# EAGLE design untitled (EAGLE 9.4.1)

## Sheet 1 of 2
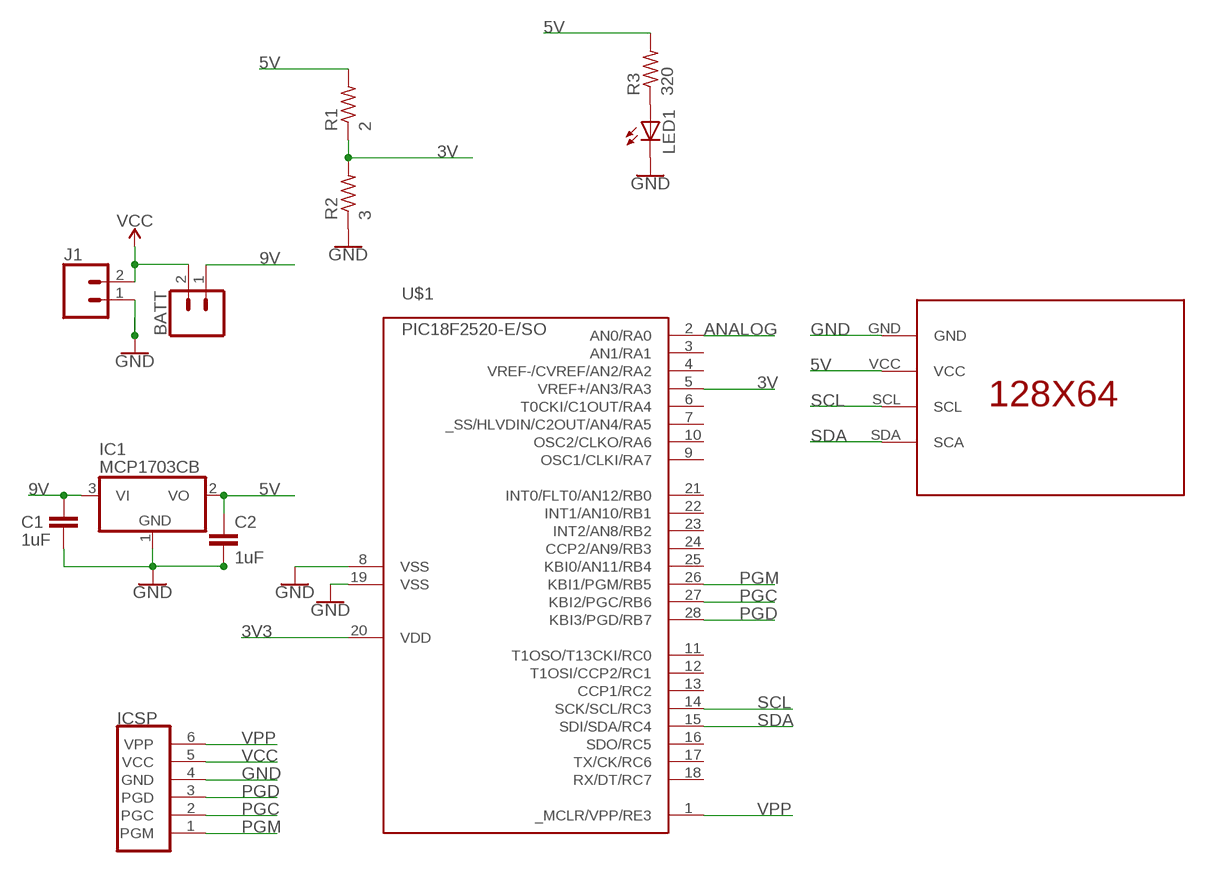
[diagram p0: schematic, sheet 1]

### Parts
BATT  CONN_02  [1X02]
C1  1uF  CAPACITOR-N0805  [0805]
C2  1uF  CAPACITOR-N0805  [0805]
IC1  MCP1703CB  [SOT23]
ICSP  PIC_ICSP_6_PIN  [MOLEX-1X6]
J1  CONN_02  [1X02]
LED1  LEDCHIP-LED0805  [CHIP-LED0805]
R1  2  R-US_R0805  [R0805]
R2  3  R-US_R0805  [R0805]
R3  320  R-US_R0805  [R0805]
U$1  PIC18F2520-E/SO  [SO-28W]
U$2  128_64_OLED_SPI  [128_64_OLED_SPI]

### Nets
3V: R1.1 R2.2 U$1.5(VREF+/AN3/RA3)
3V3: U$1.20(VDD)
5V: C2.1 IC1.2(VO) R1.2 R3.2 U$2.VCC ; also sheet 2
9V: BATT.1 C1.1 IC1.3(VI)
ANALOG: U$1.2(AN0/RA0) ; also sheet 2
GND: C1.2 C2.2 IC1.1(GND) ICSP.4(GND) J1.1 LED1.C R2.1 U$1.8(VSS) U$1.19(VSS) U$2.GND ; also sheet 2
N$1: LED1.A R3.1
PGC: ICSP.2(PGC) U$1.27(KBI2/PGC/RB6)
PGD: ICSP.3(PGD) U$1.28(KBI3/PGD/RB7)
PGM: ICSP.1(PGM) U$1.26(KBI1/PGM/RB5)
SCL: U$1.14(SCK/SCL/RC3) U$2.SCL
SDA: U$1.15(SDI/SDA/RC4) U$2.SDA(SCA)
VCC: BATT.2 ICSP.5(VCC) J1.2
VPP: ICSP.6(VPP) U$1.1(_MCLR/VPP/RE3)
Unconnected: U$1.3(AN1/RA1) U$1.4(VREF-/CVREF/AN2/RA2) U$1.6(T0CKI/C1OUT/RA4) U$1.7(_SS/HLVDIN/C2OUT/AN4/RA5) U$1.9(OSC1/CLKI/RA7) U$1.10(OSC2/CLKO/RA6) U$1.11(T1OSO/T13CKI/RC0) U$1.12(T1OSI/CCP2/RC1) U$1.13(CCP1/RC2) U$1.16(SDO/RC5) U$1.17(TX/CK/RC6) U$1.18(RX/DT/RC7) U$1.21(INT0/FLT0/AN12/RB0) U$1.22(INT1/AN10/RB1) U$1.23(INT2/AN8/RB2) U$1.24(CCP2/AN9/RB3) U$1.25(KBI0/AN11/RB4)

## Sheet 2 of 2
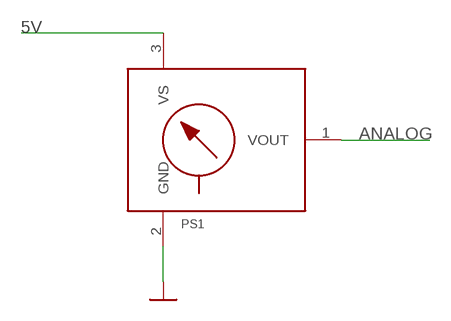
[diagram p1: schematic, sheet 2]

### Parts
PS1  MPX-867B-H  [867B-H]

### Nets
5V: PS1.3(VS) ; also sheet 1
ANALOG: PS1.1(VOUT) ; also sheet 1
GND: PS1.2(GND) ; supply symbol labelled GND-BAR ; also sheet 1
Unconnected: PS1.4(NC) PS1.5(NC) PS1.6(NC)

## Library data of the parts
BATT J1 = SparkFun-Connectors:CONN_02: Multi connection point. Often used as Generic Header-pin footprint for 0.1 inch spaced/style header connections On any of the 0.1 inch spaced packages, you can populate with these: Break Away Headers - Straight <https://www.sparkfun.com/products/116> (PRT-00116) Break Away Male Headers - Right Angle <https://www.sparkfun.com/products/553> (PRT-00553) Female Headers <https://www.sparkfun.com/products/115> (PRT-00115) Break Away Headers - Machine Pin <https://www.sparkfun.com/products/117> (PRT-00117) Break Away Female Headers - Swiss Machine Pin <https://www.sparkfun.com/products/743> (PRT-00743) For SCREWTERMINALS and SPRING TERMINALS visit here: Screw Terimnals on SparkFun.com <https://www.sparkfun.com/search/results?term=Screw+Terminals> (5mm/3.5mm/2.54mm spacing) This device is also useful as a general connection point to wire up your design to another part of your project. Our various solder wires solder well into these plated through hole pads. Hook-Up Wire - Assortment (Stranded, 22 AWG) <https://www.sparkfun.com/products/11375> (PRT-11375) Hook-Up Wire - Assortment (Solid Core, 22 AWG) <https://www.sparkfun.com/products/11367> (PRT-11367) View the entire wire category on our website here <https://www.sparkfun.com/categories/141> Special notes: Molex polarized connector foot print use with: PRT-08233 with associated crimp pins and housings. 2.54_SCREWTERM for use with PRT-10571. 3.5mm Screw Terminal footprints for PRT-08084 5mm Screw Terminal footprints for use with PRT-08432
C1 C2 = BeagleBone_Blue_R3:CAPACITOR-N
IC1 = linear:MCP1703: 250 mA, 16V, Low Quiescent Current LDO Regulator Source: http://ww1.microchip.com/downloads/en/DeviceDoc/22049b.pdf
ICSP = SparkFun-Connectors:PIC_ICSP_6_PIN: ISCP Programming connector for PICs This 6 pin header contains all the lines necessary for programming most PIC microcontrollers. Here is the connector we sell at SparkFun: Polarized Connectors - Header (6-Pin) <https://www.sparkfun.com/products/8094> (PRT-08094) It is used on this SparkFun product: SparkFun UDB5 - PIC UAV Development Board <https://www.sparkfun.com/products/11703> (DEV-11703) Also, if you need a nice PIC programmer, please check these out: MPLAB PICkit 3 <https://www.sparkfun.com/products/9973> (PGM-09973); PROD_ID: CONN-08046; SF_ID: PRT-08094
LED1 = Fidget Spinner Example:LED: LED OSRAM: - CHIPLED LG R971, LG N971, LY N971, LG Q971, LY Q971, LO R971, LY R971 LH N974, LH R974 LS Q976, LO Q976, LY Q976 LO Q996 - Hyper CHIPLED LW Q18S LB Q993, LB Q99A, LB R99A - SideLED LS A670, LO A670, LY A670, LG A670, LP A670 LB A673, LV A673, LT A673, LW A673 LH A674 LY A675 LS A676, LA A676, LO A676, LY A676, LW A676 LS A679, LY A679, LG A679 - Hyper Micro SIDELED® LS Y876, LA Y876, LO Y876, LY Y876 LT Y87S - SmartLED LW L88C, LW L88S LB L89C, LB L89S, LG L890 LS L89K, LO L89K, LY L89K LS L896, LA L896, LO L896, LY L896 - TOPLED LS T670, LO T670, LY T670, LG T670, LP T670 LSG T670, LSP T670, LSY T670, LOP T670, LYG T670 LG T671, LOG T671, LSG T671 LB T673, LV T673, LT T673, LW T673 LH T674 LS T676, LA T676, LO T676, LY T676, LB T676, LH T676, LSB T676, LW T676 LB T67C, LV T67C, LT T67C, LS T67K, LO T67K, LY T67K, LW E67C LS E67B, LA E67B, LO E67B, LY E67B, LB E67C, LV E67C, LT E67C LW T67C LS T679, LY T679, LG T679 LS T770, LO T770, LY T770, LG T770, LP T770 LB T773, LV T773, LT T773, LW T773 LH T774 LS E675, LA E675, LY E675, LS T675 LS T776, LA T776, LO T776, LY T776, LB T776 LHGB T686 LT T68C, LB T68C - Hyper Mini TOPLED® LB M676 - Mini TOPLED Santana® LG M470 LS M47K, LO M47K, LY M47K Source: http://www.osram.convergy.de LUXEON: - LUMILED® LXK2-PW12-R00, LXK2-PW12-S00, LXK2-PW14-U00, LXK2-PW14-V00 LXK2-PM12-R00, LXK2-PM12-S00, LXK2-PM14-U00 LXK2-PE12-Q00, LXK2-PE12-R00, LXK2-PE12-S00, LXK2-PE14-T00, LXK2-PE14-U00 LXK2-PB12-K00, LXK2-PB12-L00, LXK2-PB12-M00, LXK2-PB14-N00, LXK2-PB14-P00, LXK2-PB14-Q00 LXK2-PR12-L00, LXK2-PR12-M00, LXK2-PR14-Q00, LXK2-PR14-R00 LXK2-PD12-Q00, LXK2-PD12-R00, LXK2-PD12-S00 LXK2-PH12-R00, LXK2-PH12-S00 LXK2-PL12-P00, LXK2-PL12-Q00, LXK2-PL12-R00 Source: www.luxeon.com KINGBRIGHT: KA-3528ASYC Source: www.kingbright.com
PS1 = mpx-freescale:MPX*****: Generic MPX pressure sensor
R1-R3 = BeagleBone_Black_Wireless:R-US_: RESISTOR, American symbol
U$1 = pic18fxx20:PIC18*2520: PIC18*2520 Microchip FLASH Microcontroller with A/D DEVICE FEATURES Feature PIC18*2520 Program Memory (bytes) 32768 Program Memory (instructions) 16384 Interupt Sources 19 I/O Ports Ports A, B, C, (E) Capture/Compare/PWM Modules 2 Enhanced Capture/Compare/PWM Modules 0 Parallel Communications (PSP) No 10-bit Analog-to-Digital Module 10 input Channels Package Types 28-pin PDIP 28-pin SOIC 28-pin QFN NOTES: F only after 18, means standard voltage range from 4.2v to 5.5v LF after 18, means extended voltage range from 2.0v to 5.5v -E before / denotes extended temperature range from -40°C to +120°C -I before / denotes industrial temperature range from -40°C to +85°C /PT suffix denotes TQFP package /SO suffix denotes SOIC package /SP suffix denotes Skinny Plastic DIP package /P suffix denotes Plastic DIP package /ML suffix denotes QFN package
U$2 = 128X64 Oled:128_64_OLED_SPI

## Net classes
0 default: width 0.381 mm

## Board
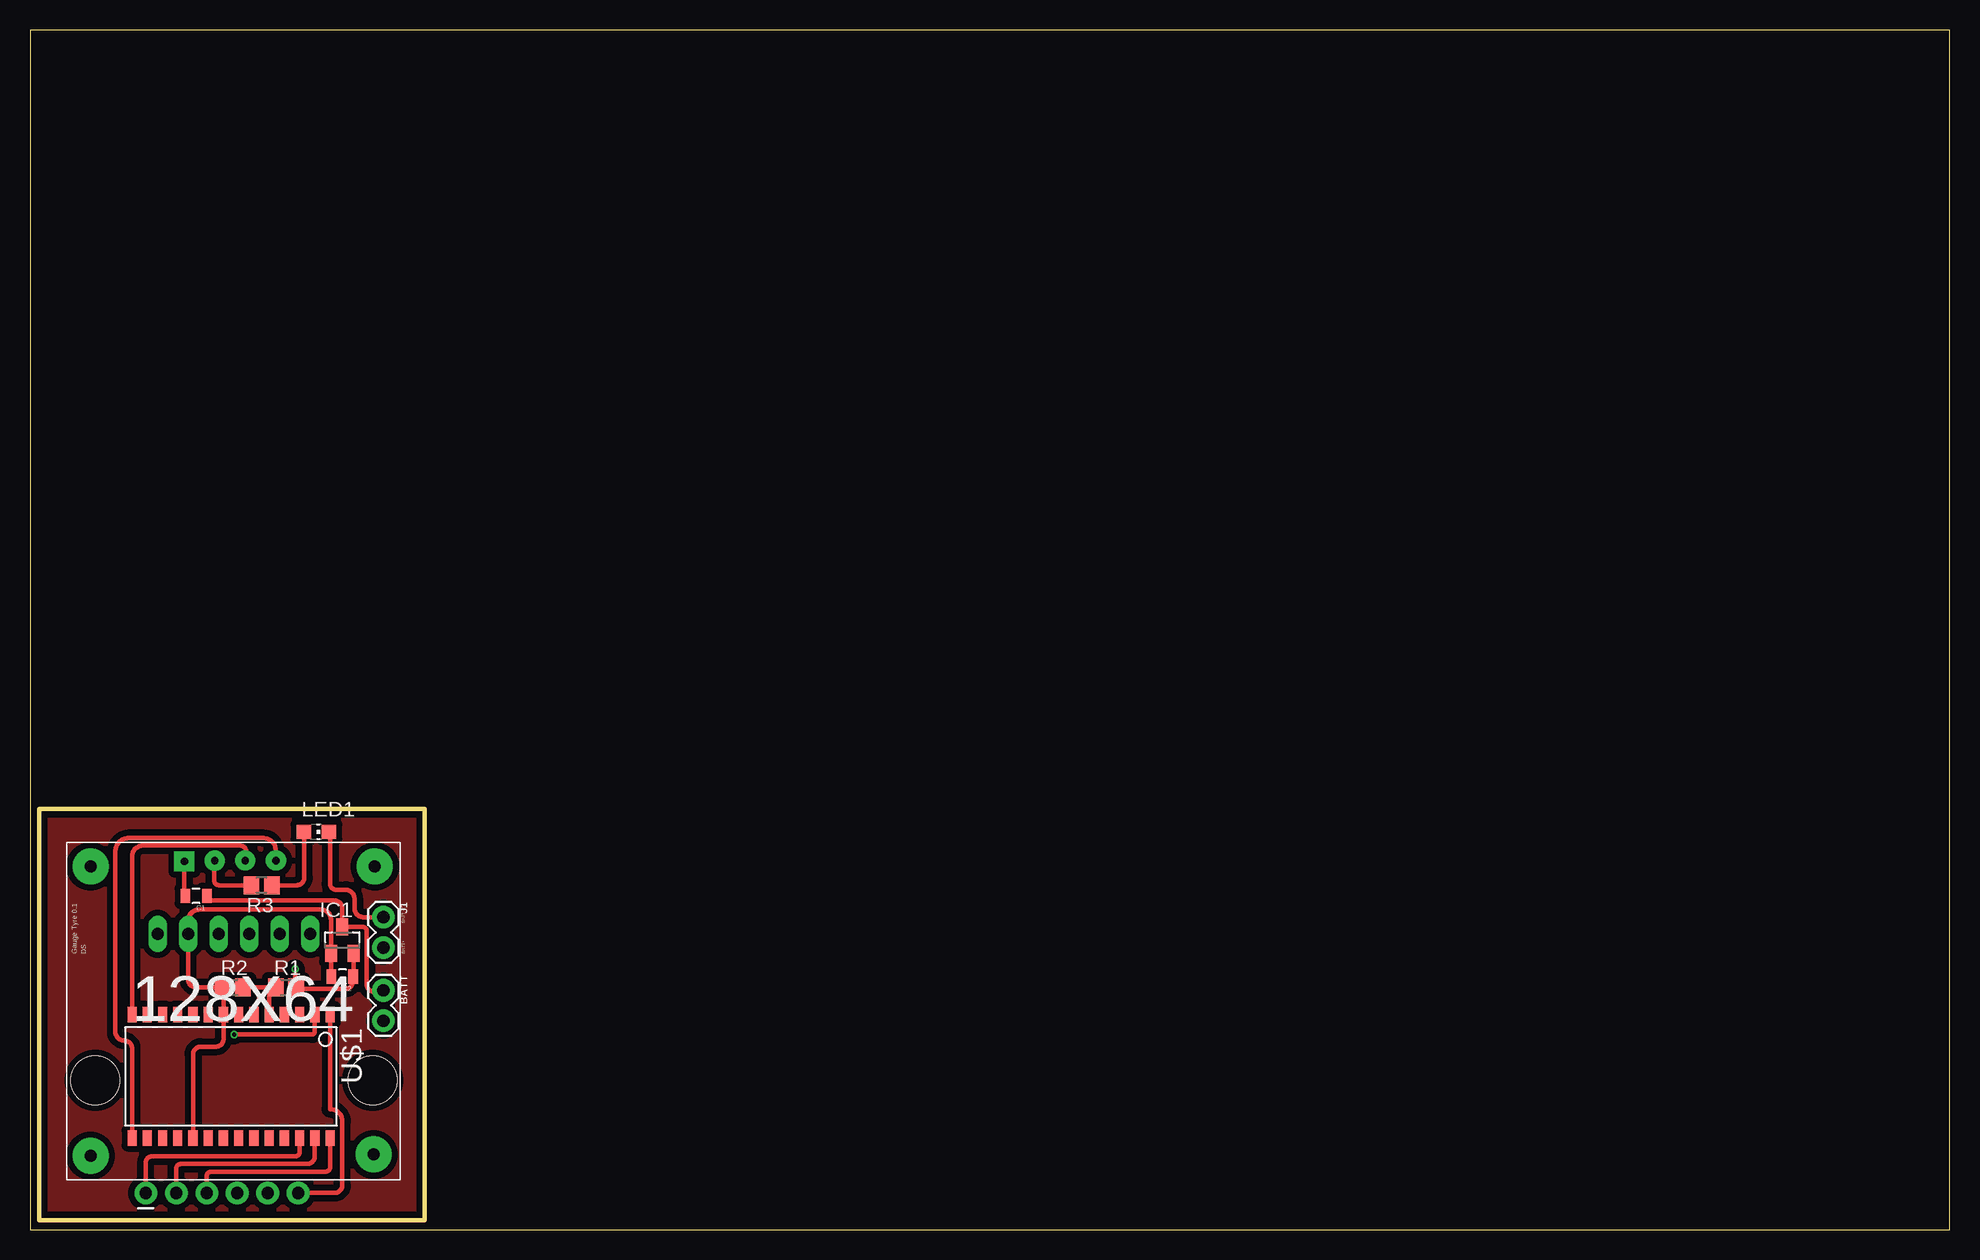
[diagram p2: board, top side]
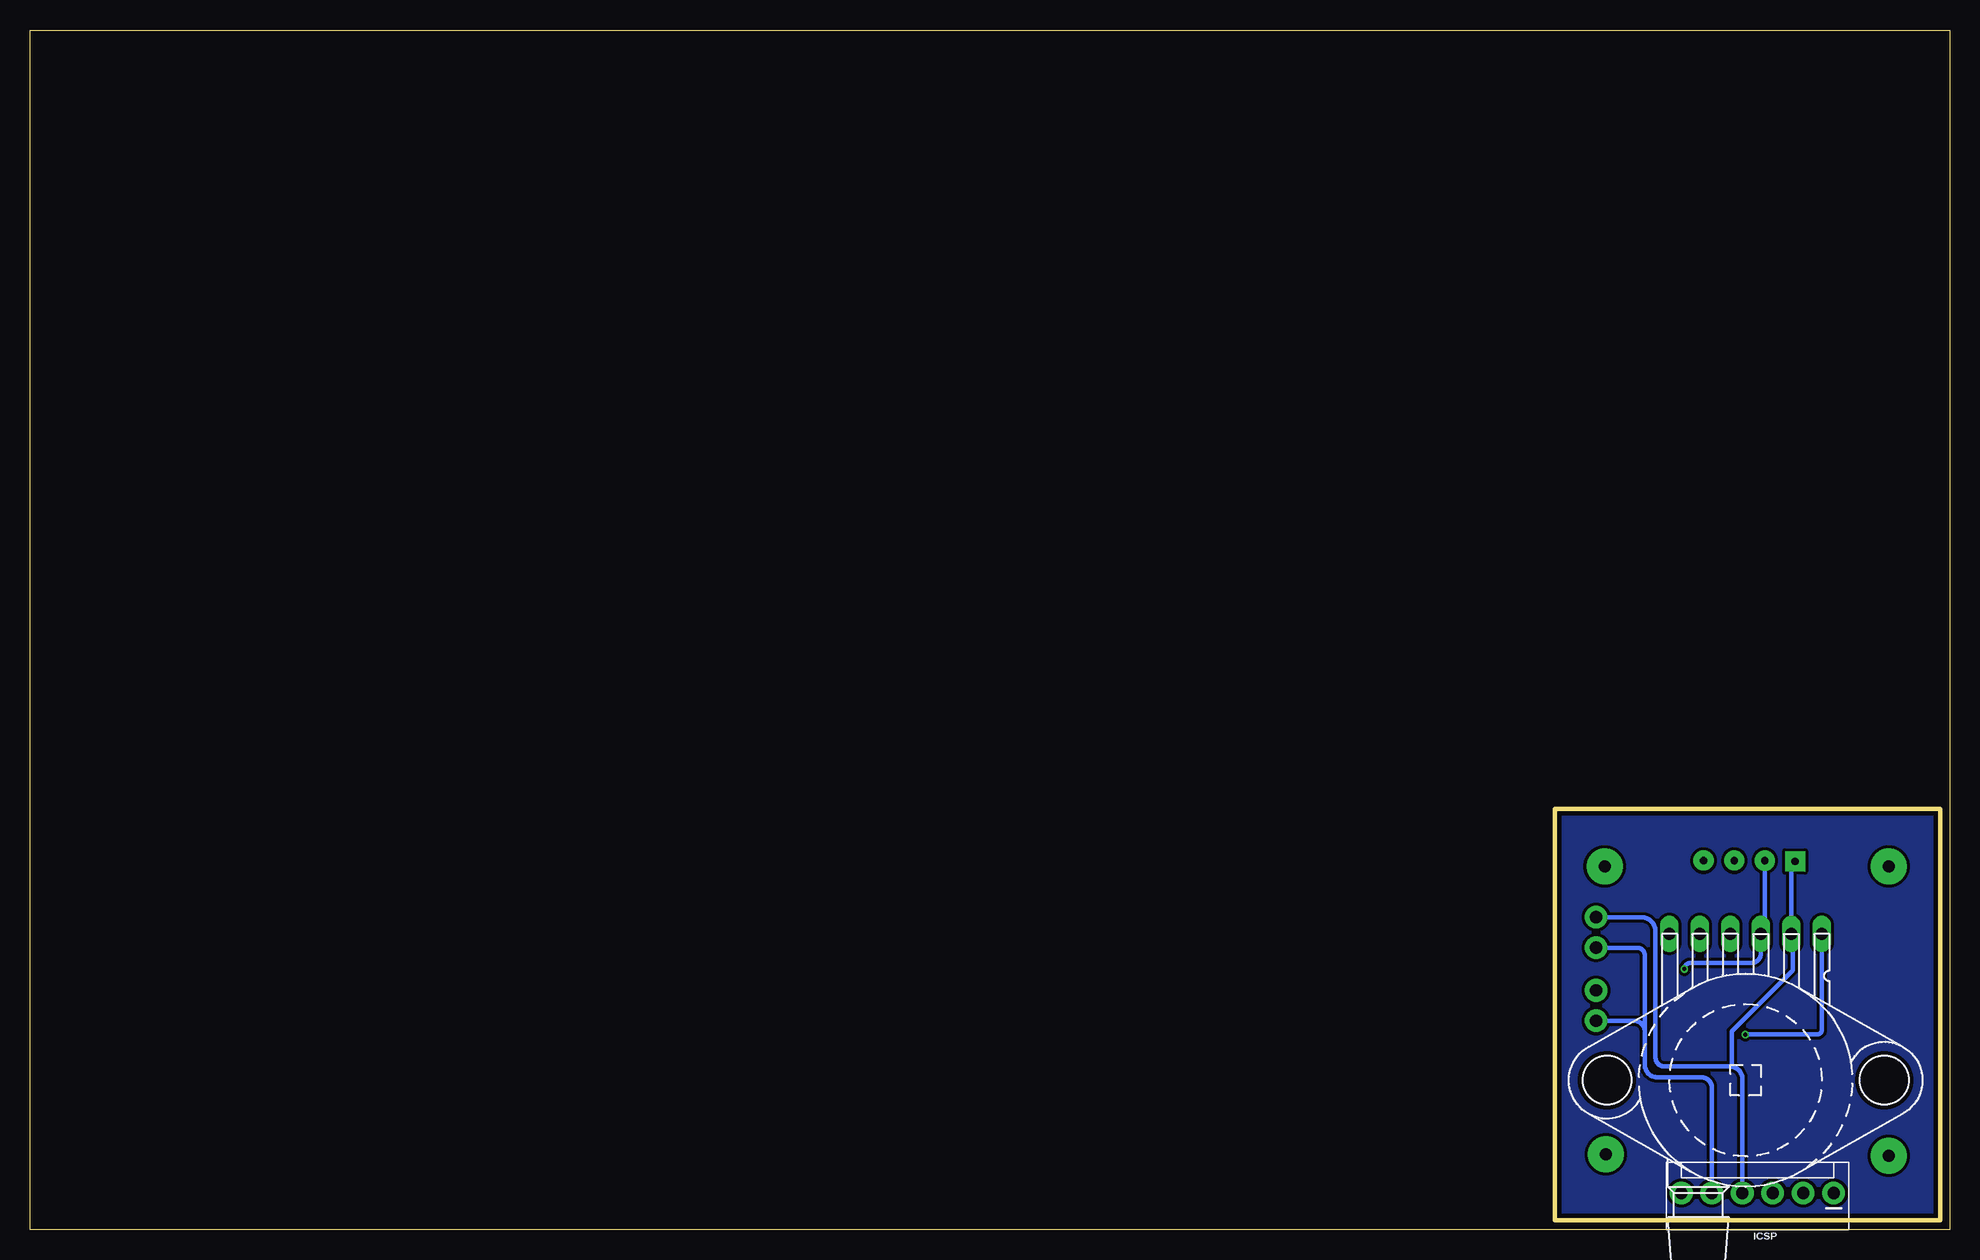
[diagram p3: board, bottom side, seen from below]

Size 160 x 100 mm. Coordinates in mm from the lower left corner, seen from the top.
Outline: 0,0 160,0 160,100 0,100 0,0
Outline: 0.76,35.05 32.89,35.05 32.89,0.76 0.76,0.76 0.76,35.05
Copper layers (1*16): Top 0.035559375mm / dielectric 1.6mm / Bottom 0.035559375mm
Design rules "oshpark-2layer": minimum track width 6mil, minimum drill 10mil, track to track 6mil, track to pad 6mil, pad to pad 6mil, via to via 6mil, smd to smd 6mil, copper to edge 15mil, drill to drill 6mil, minimum pad ring 5mil, minimum via ring 5mil, stop-mask expansion 2.5mil, vias tented up to drill 0mil, thermal gap 10mil

### Footprints (pad centres in the part's own frame; a part is rotated, then mirrored left to right if it is on the bottom)
1X02 = drill 1.016 pad 1.88: 1 0,0; 2 2.54,0
0805 = smd 0.8 x 1.2: 1 -0.9,0; 2 0.9,0
SOT23 = smd 1 x 1.4: 1 -0.95,-1.1; 2 0.95,-1.1; 3 0,1.1
MOLEX-1X6 = drill 1.016 pad 1.88: 1 0,0; 2 2.54,0; 3 5.08,0; 4 7.62,0; 5 10.16,0; 6 12.7,0
CHIP-LED0805 = smd 1.2 x 1.2: A 0,-1.05; C 0,1.05
867B-H = drill 1.016 long: 1 -6.35,-12.192; 2 -3.81,-12.192; 3 -1.27,-12.192; 4 1.27,-12.192; 5 3.81,-12.192; 6 6.35,-12.192 | hole 4.064: -11.557,0; 11.557,0
R0805 = smd 1.3 x 1.5: 1 -0.85,0; 2 0.85,0
SO-28W = smd 0.762 x 1.27: 1 -7.62,-5.207; 2 -6.35,-5.207; 3 -5.08,-5.207; 4 -3.81,-5.207; 5 -2.54,-5.207; 6 -1.27,-5.207; 7 0,-5.207; 8 1.27,-5.207; 9 2.54,-5.207; 10 3.81,-5.207; 11 5.08,-5.207; 12 6.35,-5.207; 13 7.62,-5.207; 14 8.89,-5.207; 15 8.89,5.08; 16 7.62,5.08; 17 6.35,5.08; 18 5.08,5.08; 19 3.81,5.08; 20 2.54,5.08; 21 1.27,5.08; 22 0,5.08; 23 -1.27,5.08; 24 -2.54,5.08; 25 -3.81,5.08; 26 -5.08,5.08; 27 -6.35,5.08; 28 -7.62,5.08
128_64_OLED_SPI = drill 0.6 pad 1.676 square: GND 9.82,-1.57 | drill 1 pad 3: P$5 2,-2; P$6 25.7,-2; P$7 25.6,-26; P$8 2,-26.1 | drill 0.6 pad 1.676: SCL 14.9,-1.5; SDA 17.45,-1.5; VCC 12.35,-1.51

### Placement (x,y rotation side)
BATT  29.46,19.94 270 top
C1  13.84,27.81 180 top
C2  26.04,21.08 180 top
IC1  26.04,24.13 0 top
ICSP  9.65,3.05 180 bottom
J1  29.46,26.04 270 top
LED1  23.88,33.15 270 top
PS1  16.99,12.45 180 bottom
R1  21.34,20.19 0 top
R2  16.89,20.19 0 top
R3  19.3,28.7 180 top
U$1  17.4,12.7 180 top
U$2  3.05,32.26 0 top

### Tracks (layer width: path | path; a pad name or v marks a point on that pad's centre or on a via)
3V
  Top 0.381: R2.2 R1.1 arc90 19.94,19.65 U$1.5
5V  (via drill 0.35)
  Top 0.381: R1.2 22.19,19.9 | 26.85,23.34 26.98,23.2 IC1.2 26.98,21.13 C2.1 26.92,20.7 arc-90 26.29,20.07 22.31,20.07 arc90 R1.2 | R3.2 15.75,28.7 arc-90 15.37,29.08 15.37,30.72 arc-90 U$2.VCC | v22.1,21.72 22.1,20.28 arc-90 R1.2
  Bottom 0.381: U$2.VCC 15.4,24.96 arc90 PS1.3 15.72,23.01 arc90 16.51,22.23 21.59,22.23 arc-90 v22.1,21.72
9V
  Top 0.381: C1.1 15.12,27.43 25.36,27.43 arc-90 26.04,26.75 IC1.3 27.73,25.23 arc-90 28.07,24.89 28.07,20.45 arc90 28.7,19.81 29.34,19.81 arc90 BATT.1
ANALOG  (via drill 0.35)
  Top 0.381: U$1.2 23.75,16.51 arc-90 23.5,16.26 v17.02,16.26
  Bottom 0.381: v17.02,16.26 11.05,16.26 arc-90 10.64,16.66 PS1.1
BOTTOMPOLY
  pour Bottom (isolate 0.254): 32.51,1.14 1.14,1.14 1.14,34.67 32.51,34.67
GND
  Top 0.381: U$2.GND 12.87,30.79 | U$2.GND 12.9,30.69 arc-90 12.95,30.73 | U$2.GND 12.87,27.89 arc90 C1.2 | U$1.19 13.59,14.61 arc-90 14.22,15.24 15.49,15.24 arc90 16.13,15.88 U$1.8 16.13,20.11 arc-90 R2.1 13.84,20.19 arc-90 13.18,20.85 PS1.2 13.18,25.76 arc-90 14.1,26.67 24.26,26.67 arc-90 25.09,25.84 IC1.1 | 25.15,33.15 LED1.C 25.02,33.05 25.02,28.83 arc90 25.53,28.32 26.29,28.32 arc-90 27.05,27.56 27.05,26.8 arc90 27.81,26.04 J1.1 | 25.07,22.95 IC1.1 | IC1.1 25.09,21.13 C2.2
  Bottom 0.381: 12.99,30.56 arc90 U$2.GND | 12.95,30.61 12.99,30.56 | 12.99,30.56 13.12,30.56 arc90 13.18,30.5 PS1.2 13.07,24.54 13.07,21.6 18.14,16.54 18.14,13.6 18.29,13.59 | 18.29,13.59 23.75,13.59 arc90 24.51,14.35 24.51,24.89 arc-90 25.65,26.04 J1.1 | 18.29,13.59 arc90 17.27,12.57 ICSP.4
N$1
  Top 0.381: R3.1 22.23,28.7 arc90 22.86,29.34 22.86,33.11 arc90 LED1.A
PGC
  Top 0.381: ICSP.2 12.19,5.08 arc-90 12.57,5.46 23.11,5.46 arc90 23.75,6.1 U$1.27
PGD
  Top 0.381: ICSP.3 14.73,4.45 arc-90 15.11,4.83 24.64,4.83 arc90 25.02,5.21 U$1.28
PGM
  Top 0.381: ICSP.1 9.65,5.59 arc-90 10.16,6.1 22.1,6.1 arc90 22.48,6.48 U$1.26
POLY
  pour Top (isolate 0.508): 1.14,34.67 32.51,34.67 32.51,1.14 1.14,1.14
SCL
  Top 0.381: U$1.14 8.51,31.11 arc-90 9.4,32 17.53,32 arc-90 18.03,31.5 18.03,30.84 arc-90 U$2.SCL
SDA
  Top 0.381: U$1.15 8.51,15.11 arc90 7.87,15.75 arc-90 7.11,16.51 7.11,31.5 arc-90 8.26,32.64 19.43,32.64 arc-90 20.5,31.57 U$2.SDA
VCC
  Bottom 0.381: ICSP.5 19.81,11.81 arc-90 20.7,12.7 24.38,12.7 arc90 25.4,13.72 25.4,16.64 | BATT.2 26.29,17.4 arc81 25.4,16.64 | J1.2 26.04,23.5 arc90 25.4,22.86 25.4,16.64
VPP
  Top 0.381: ICSP.6 25.4,3.05 arc90 26.04,3.68 26.04,9.02 arc90 25.02,10.03 U$1.1

### Text on the board
tPlace: BATT - | Gauge Tyre 0.1 | DS | BATT+